# EAGLE design trill-breakout (EAGLE 6.5.0)
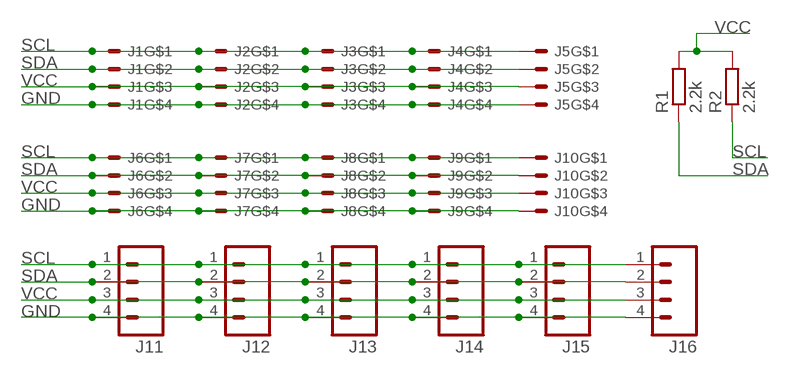
[diagram p0: schematic, sheet 1]

## Parts
J1  GROVE-SMT  [JST-PH-4-SMT]
J2  GROVE-SMT  [JST-PH-4-SMT]
J3  GROVE-SMT  [JST-PH-4-SMT]
J4  GROVE-SMT  [JST-PH-4-SMT]
J5  GROVE-SMT  [JST-PH-4-SMT]
J6  GROVE-SMT  [JST-PH-4-SMT]
J7  GROVE-SMT  [JST-PH-4-SMT]
J8  GROVE-SMT  [JST-PH-4-SMT]
J9  GROVE-SMT  [JST-PH-4-SMT]
J10  GROVE-SMT  [JST-PH-4-SMT]
J11  M04LONGPADS  [1X04_LONGPADS]
J12  M04LONGPADS  [1X04_LONGPADS]
J13  M04LONGPADS  [1X04_LONGPADS]
J14  M04LONGPADS  [1X04_LONGPADS]
J15  M04LONGPADS  [1X04_LONGPADS]
J16  M04LONGPADS  [1X04_LONGPADS]
R1  2.2k  R-EU_R0603  [R0603]
R2  2.2k  R-EU_R0603  [R0603]

## Nets
GND: J1.4 J2.4 J3.4 J4.4 J5.4 J6.4 J7.4 J8.4 J9.4 J10.4 J11.4 J12.4 J13.4 J14.4 J15.4 J16.4
SCL: J1.1 J2.1 J3.1 J4.1 J5.1 J6.1 J7.1 J8.1 J9.1 J10.1 J11.1 J12.1 J13.1 J14.1 J15.1 J16.1 R2.1
SDA: J1.2 J2.2 J3.2 J4.2 J5.2 J6.2 J7.2 J8.2 J9.2 J10.2 J11.2 J12.2 J13.2 J14.2 J15.2 J16.2 R1.1
VCC: J1.3 J2.3 J3.3 J4.3 J5.3 J6.3 J7.3 J8.3 J9.3 J10.3 J11.3 J12.3 J13.3 J14.3 J15.3 J16.3 R1.2 R2.2

## Library data of the parts
J1-J10 = custom:GROVE-SMT
J11-J16 = SparkFun-Connectors:M04: Header 4 Standard 4-pin 0.1" header. Use with straight break away headers (SKU : PRT-00116), right angle break away headers (PRT-00553), swiss pins (PRT-00743), machine pins (PRT-00117), and female headers (PRT-00115). Molex polarized connector foot print use with SKU : PRT-08231 with associated crimp pins and housings. 1MM SMD Version SKU: PRT-10208
R1 R2 = rcl:R-EU_: RESISTOR, European symbol

## Board
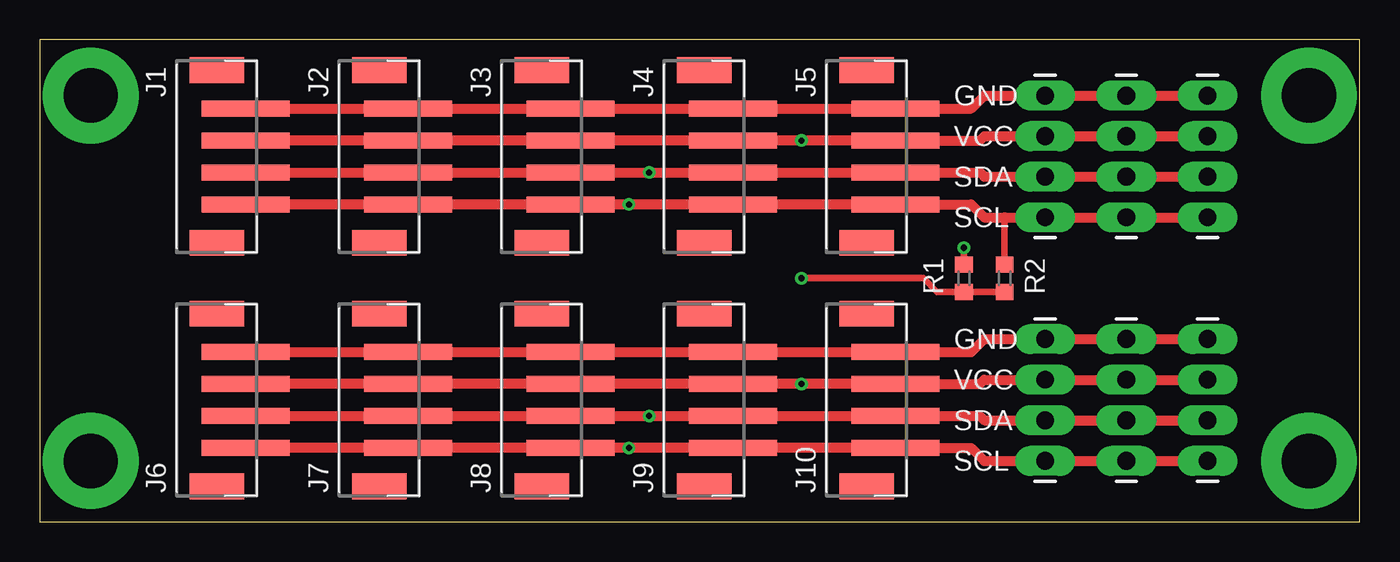
[diagram p1: board, top side]
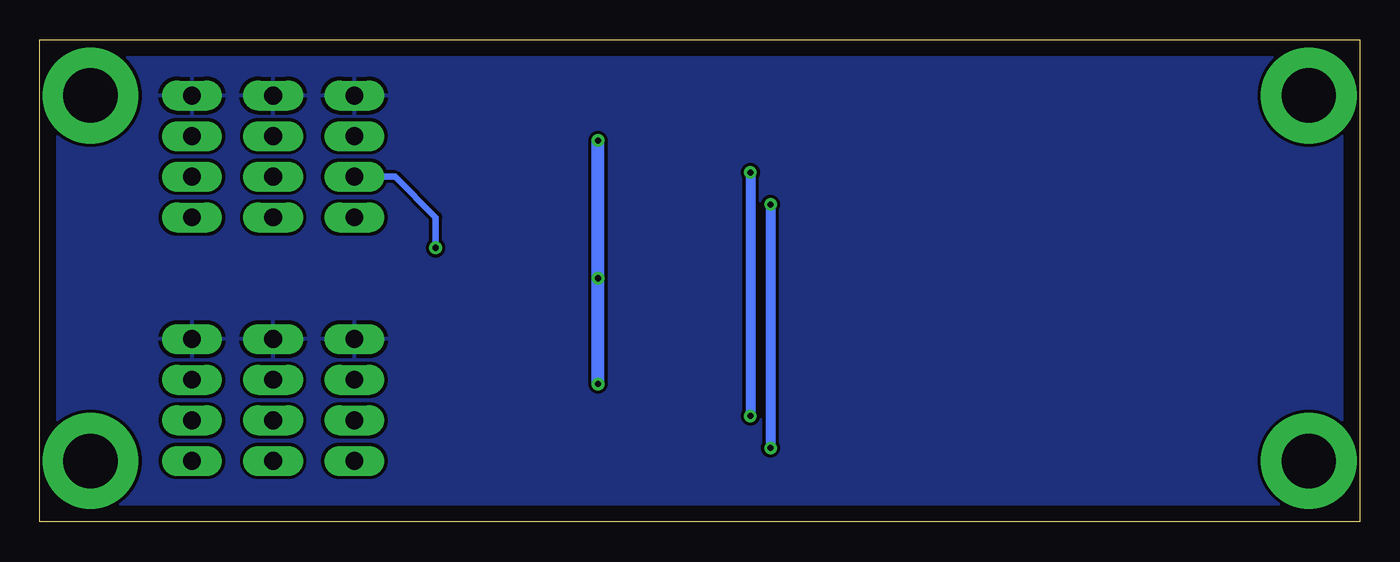
[diagram p2: board, bottom side, seen from below]

Size 82.53 x 30.15 mm. Coordinates in mm from the lower left corner, seen from the top.
Outline: 0,0 82.53,0 82.53,30.15 0,30.15 0,0
Copper layers (1*16): Top 0.035mm / dielectric 1.5mm / Bottom 0.035mm
Design rules "default *": minimum track width 8mil, minimum drill 15mil, track to track 8mil, track to pad 8mil, pad to pad 8mil, via to via 8mil, smd to smd 0mil, copper to edge 40mil, drill to drill 8mil, minimum pad ring 10mil, minimum via ring 8mil, stop-mask expansion 4mil, vias tented up to drill 0mil, thermal gap 10mil

### Footprints (pad centres in the part's own frame; a part is rotated, then mirrored left to right if it is on the bottom)
JST-PH-4-SMT = smd 1 x 5.5: 1 -3,-0.8; 2 -1,-0.8; 3 1,-0.8; 4 3,-0.8 | smd 1.6 x 3.4: NC1 -5.4,1; NC2 5.4,1
1X04_LONGPADS = drill 1.118 pad 1.88 long: 1 0,0; 2 2.54,0; 3 5.08,0; 4 7.62,0
R0603 = smd 1 x 1.1: 1 -0.85,0; 2 0.85,0

### Placement (x,y rotation side)
J1  12.07,22.86 90 top
J2  22.23,22.86 90 top
J3  32.39,22.86 90 top
J4  42.55,22.86 90 top
J5  52.7,22.86 90 top
J6  12.07,7.62 90 top
J7  22.23,7.62 90 top
J8  32.39,7.62 90 top
J9  42.55,7.62 90 top
J10  52.7,7.62 90 top
J11  62.87,3.81 90 top
J12  67.94,3.81 90 top
J13  73.03,3.81 90 top
J14  62.87,19.05 90 top
J15  67.94,19.05 90 top
J16  73.03,19.05 90 top
R1  57.79,15.24 270 top
R2  60.33,15.24 270 top

### Tracks (layer width: path | path; a pad name or v marks a point on that pad's centre or on a via)
GND
  Top 0.61: J1.4 J2.4 J3.4 J4.4 J5.4 58.24,25.86 59.05,26.67 J14.4 J15.4 J16.4 | J6.4 J7.4 J8.4 J9.4 J10.4 58.24,10.62 59.05,11.43 J11.4 J12.4 J13.4
  pour Bottom: -0.63,30.48 83.19,30.48 83.19,-1.27 -0.63,-1.27
N$1  (via drill 3.4 pad 5.99)
  other vias: 3.18,26.67
N$2  (via drill 3.4 pad 5.99)
  other vias: 3.18,3.81
N$3  (via drill 3.4 pad 5.99)
  other vias: 79.38,3.81
N$4  (via drill 3.4 pad 5.99)
  other vias: 79.38,26.67
SCL  (via drill 0.38)
  Top 0.406: R2.1 60.33,19.05
  Top 0.61: J6.1 J7.1 J8.1 v36.83,4.62 J9.1 J10.1 58.24,4.62 59.05,3.81 J11.1 J12.1 J13.1 | J1.1 J2.1 J3.1 v36.83,19.86 J4.1 J5.1 58.24,19.86 59.05,19.05 60.33,19.05 J14.1 J15.1 J16.1
  Bottom 0.61: v36.83,19.86 v36.83,4.62
SDA  (via drill 0.38)
  Top 0.406: R1.1 v57.79,17.14
  Top 0.61: J6.2 J7.2 J8.2 v38.1,6.62 J9.2 J10.2 58.79,6.62 59.05,6.35 J11.2 J12.2 J13.2 | J1.2 J2.2 J3.2 v38.1,21.86 J4.2 J5.2 58.79,21.86 59.05,21.59 J14.2 J15.2 J16.2
  Bottom 0.406: v57.79,17.14 57.79,19.05 60.33,21.59 J14.2
  Bottom 0.61: v38.1,21.86 v38.1,6.62
VCC  (via drill 0.38)
  Top 0.406: R2.2 R1.2 56.09,14.39 55.24,15.24 v47.62,15.24
  Top 0.61: J1.3 J2.3 J3.3 J4.3 v47.62,23.86 J5.3 58.79,23.86 59.05,24.13 J14.3 J15.3 J16.3 | J6.3 J7.3 J8.3 J9.3 v47.62,8.62 J10.3 58.79,8.62 59.05,8.89 J11.3 J12.3 J13.3
  Bottom 0.813: v47.62,8.62 v47.62,15.24 v47.62,23.86

### Text on the board
tPlace: GND | VCC | SDA | SCL | GND | VCC | SDA | SCL